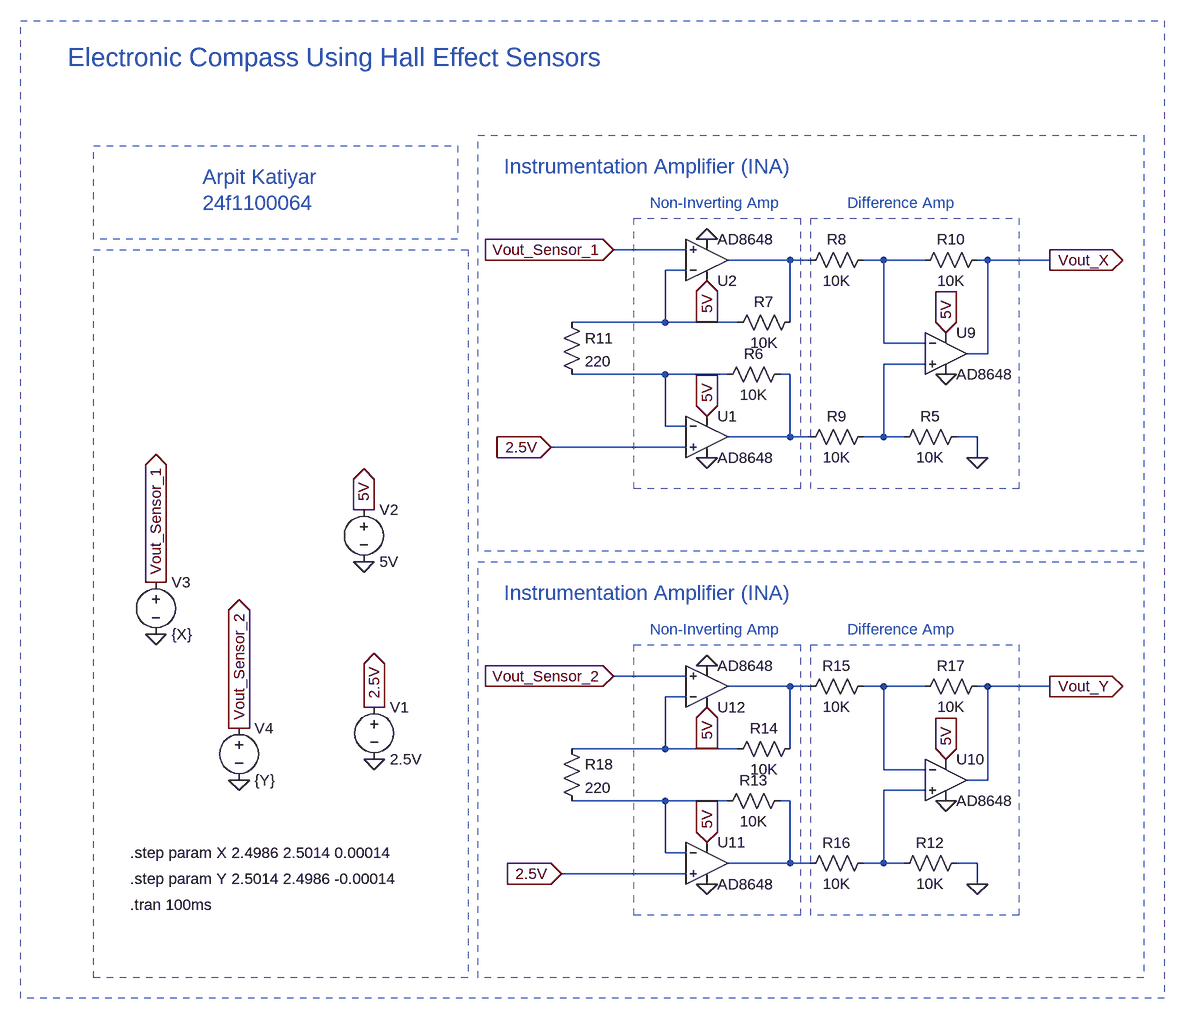
[diagram p0: schematic 24F1100064_Week 3.asc]
24F1100064_Week 3.asc, the LTspice schematic file:
Version 4
SHEET 1 1540 1028
WIRE 800 -128 688 -128
WIRE 960 -112 864 -112
WIRE 992 -112 960 -112
WIRE 1104 -112 1072 -112
WIRE 1168 -112 1104 -112
WIRE 1264 -112 1248 -112
WIRE 1360 -112 1264 -112
WIRE 800 -96 768 -96
WIRE 768 -16 768 -96
WIRE 768 -16 624 -16
WIRE 880 -16 768 -16
WIRE 960 -16 960 -112
WIRE 1104 16 1104 -112
WIRE 1168 16 1104 16
WIRE 1264 32 1264 -112
WIRE 1264 32 1232 32
WIRE 1168 48 1104 48
WIRE 768 64 624 64
WIRE 864 64 768 64
WIRE 960 64 944 64
WIRE 768 144 768 64
WIRE 800 144 768 144
WIRE 960 160 960 64
WIRE 960 160 864 160
WIRE 992 160 960 160
WIRE 1104 160 1104 48
WIRE 1104 160 1072 160
WIRE 1136 160 1104 160
WIRE 1248 160 1216 160
WIRE 800 176 592 176
WIRE 1248 192 1248 160
WIRE 800 528 688 528
WIRE 960 544 864 544
WIRE 992 544 960 544
WIRE 1104 544 1072 544
WIRE 1168 544 1104 544
WIRE 1264 544 1248 544
WIRE 1360 544 1264 544
WIRE 800 560 768 560
WIRE 768 640 768 560
WIRE 768 640 624 640
WIRE 880 640 768 640
WIRE 960 640 960 544
WIRE 1104 672 1104 544
WIRE 1168 672 1104 672
WIRE 1264 688 1264 544
WIRE 1264 688 1232 688
WIRE 1168 704 1104 704
WIRE 768 720 624 720
WIRE 864 720 768 720
WIRE 960 720 944 720
WIRE 768 800 768 720
WIRE 800 800 768 800
WIRE 960 816 960 720
WIRE 960 816 864 816
WIRE 992 816 960 816
WIRE 1104 816 1104 704
WIRE 1104 816 1072 816
WIRE 1136 816 1104 816
WIRE 1248 816 1216 816
WIRE 800 832 608 832
WIRE 1248 848 1248 816
FLAG 688 -128 Vout_Sensor_1
IOPIN 688 -128 In
FLAG 688 528 Vout_Sensor_2
IOPIN 688 528 In
FLAG 304 352 0
FLAG 320 656 0
FLAG 304 272 5V
IOPIN 304 272 Out
FLAG 320 576 2.5V
IOPIN 320 576 Out
FLAG -16 464 0
FLAG 112 688 0
FLAG -16 384 Vout_Sensor_1
IOPIN -16 384 Out
FLAG 112 608 Vout_Sensor_2
IOPIN 112 608 Out
FLAG 832 -144 0
FLAG 832 192 0
FLAG 1200 64 0
FLAG 832 128 5V
IOPIN 832 128 In
FLAG 832 -80 5V
IOPIN 832 -80 In
FLAG 1200 0 5V
IOPIN 1200 0 In
FLAG 1360 -112 Vout_X
IOPIN 1360 -112 Out
FLAG 1248 192 0
FLAG 832 512 0
FLAG 832 848 0
FLAG 1200 720 0
FLAG 832 784 5V
IOPIN 832 784 In
FLAG 832 576 5V
IOPIN 832 576 In
FLAG 1200 656 5V
IOPIN 1200 656 In
FLAG 1360 544 Vout_Y
IOPIN 1360 544 Out
FLAG 1248 848 0
FLAG 608 832 2.5V
IOPIN 608 832 In
FLAG 592 176 2.5V
IOPIN 592 176 In
SYMBOL voltage 320 560 R0
WINDOW 123 0 0 Left 0
WINDOW 39 0 0 Left 0
SYMATTR InstName V1
SYMATTR Value 2.5V
SYMBOL voltage 304 256 R0
WINDOW 123 0 0 Left 0
WINDOW 39 0 0 Left 0
SYMATTR InstName V2
SYMATTR Value 5V
SYMBOL voltage -16 368 R0
WINDOW 123 0 0 Left 0
WINDOW 39 0 0 Left 0
SYMATTR InstName V3
SYMATTR Value {X}
SYMBOL voltage 112 592 R0
WINDOW 123 0 0 Left 0
WINDOW 39 0 0 Left 0
SYMATTR InstName V4
SYMATTR Value {Y}
SYMBOL res 1232 144 R90
WINDOW 0 0 56 VBottom 2
WINDOW 3 32 56 VTop 2
SYMATTR InstName R5
SYMATTR Value 10K
SYMBOL res 960 48 R90
WINDOW 0 0 56 VBottom 2
WINDOW 3 32 56 VTop 2
SYMATTR InstName R6
SYMATTR Value 10K
SYMBOL res 976 -32 R90
WINDOW 0 0 56 VBottom 2
WINDOW 3 32 56 VTop 2
SYMATTR InstName R7
SYMATTR Value 10K
SYMBOL res 1088 -128 R90
WINDOW 0 0 56 VBottom 2
WINDOW 3 32 56 VTop 2
SYMATTR InstName R8
SYMATTR Value 10K
SYMBOL res 1088 144 R90
WINDOW 0 0 56 VBottom 2
WINDOW 3 32 56 VTop 2
SYMATTR InstName R9
SYMATTR Value 10K
SYMBOL res 1264 -128 R90
WINDOW 0 0 56 VBottom 2
WINDOW 3 32 56 VTop 2
SYMATTR InstName R10
SYMATTR Value 10K
SYMBOL res 608 -32 R0
SYMATTR InstName R11
SYMATTR Value 220
SYMBOL res 1232 800 R90
WINDOW 0 0 56 VBottom 2
WINDOW 3 32 56 VTop 2
SYMATTR InstName R12
SYMATTR Value 10K
SYMBOL res 960 704 R90
WINDOW 0 0 56 VBottom 2
WINDOW 3 32 56 VTop 2
SYMATTR InstName R13
SYMATTR Value 10K
SYMBOL res 976 624 R90
WINDOW 0 0 56 VBottom 2
WINDOW 3 32 56 VTop 2
SYMATTR InstName R14
SYMATTR Value 10K
SYMBOL res 1088 528 R90
WINDOW 0 0 56 VBottom 2
WINDOW 3 32 56 VTop 2
SYMATTR InstName R15
SYMATTR Value 10K
SYMBOL res 1088 800 R90
WINDOW 0 0 56 VBottom 2
WINDOW 3 32 56 VTop 2
SYMATTR InstName R16
SYMATTR Value 10K
SYMBOL res 1264 528 R90
WINDOW 0 0 56 VBottom 2
WINDOW 3 32 56 VTop 2
SYMATTR InstName R17
SYMATTR Value 10K
SYMBOL res 608 624 R0
SYMATTR InstName R18
SYMATTR Value 220
SYMBOL OpAmps\\AD8648 832 96 R0
SYMATTR InstName U1
SYMBOL OpAmps\\AD8648 832 -48 M180
SYMATTR InstName U2
SYMBOL OpAmps\\AD8648 1200 -32 R0
SYMATTR InstName U9
SYMBOL OpAmps\\AD8648 1200 624 R0
SYMATTR InstName U10
SYMBOL OpAmps\\AD8648 832 752 R0
SYMATTR InstName U11
SYMBOL OpAmps\\AD8648 832 608 M180
SYMATTR InstName U12
TEXT -56 800 Left 2 !.step param X 2.4986 2.5014 0.00014
TEXT -56 840 Left 2 !.step param Y 2.5014 2.4986 -0.00014
TEXT -56 880 Left 2 !.tran 100ms
TEXT -152 -424 Left 4 ;Electronic Compass Using Hall Effect Sensors
TEXT 56 -240 Left 3 ;Arpit Katiyar
TEXT 56 -200 Left 3 ;24f1100064
TEXT 520 -256 Left 3 ;Instrumentation Amplifier (INA)
TEXT 744 -200 Left 2 ;Non-Inverting Amp
TEXT 1048 -200 Left 2 ;Difference Amp
TEXT 520 400 Left 3 ;Instrumentation Amplifier (INA)
TEXT 744 456 Left 2 ;Non-Inverting Amp
TEXT 1048 456 Left 2 ;Difference Amp
RECTANGLE Normal 448 -144 -112 -288 2
RECTANGLE Normal 976 240 720 -176 2
RECTANGLE Normal 1312 240 992 -176 2
RECTANGLE Normal 1504 336 480 -304 2
RECTANGLE Normal 976 896 720 480 2
RECTANGLE Normal 1312 896 992 480 2
RECTANGLE Normal 1504 992 480 352 2
RECTANGLE Normal 464 992 -112 -128 2
RECTANGLE Normal 1536 1024 -224 -480 2

The netlist it stands for:
* 24F1100064_Week 3.asc
V1 2.5V 0 2.5V
V2 5V 0 5V
V3 Vout_Sensor_1 0 {X}
V4 Vout_Sensor_2 0 {Y}
R5 0 N004 10K
R6 N006 N005 10K
R7 N001 N003 10K
R8 N002 N001 10K
R9 N004 N006 10K
R10 Vout_X N002 10K
R11 N003 N005 220
R12 0 N010 10K
R13 N012 N011 10K
R14 N007 N009 10K
R15 N008 N007 10K
R16 N010 N012 10K
R17 Vout_Y N008 10K
R18 N009 N011 220
XU1 2.5V N005 5V 0 N006 AD8648  ; pins In+ In- V+ V- OUT
XU2 Vout_Sensor_1 N003 5V 0 N001 AD8648  ; pins In+ In- V+ V- OUT
XU9 N004 N002 5V 0 Vout_X AD8648  ; pins In+ In- V+ V- OUT
XU10 N010 N008 5V 0 Vout_Y AD8648  ; pins In+ In- V+ V- OUT
XU11 2.5V N011 5V 0 N012 AD8648  ; pins In+ In- V+ V- OUT
XU12 Vout_Sensor_2 N009 5V 0 N007 AD8648  ; pins In+ In- V+ V- OUT
.step param X 2.4986 2.5014 0.00014
.step param Y 2.5014 2.4986 -0.00014
.tran 100ms
* Electronic Compass Using Hall Effect Sensors
* Arpit Katiyar
* 24f1100064
* Instrumentation Amplifier (INA)
* Non-Inverting Amp
* Difference Amp
* Instrumentation Amplifier (INA)
* Non-Inverting Amp
* Difference Amp
.lib ADI.lib
.backanno
.end